# EAGLE schematic Receiver_Schematic_Visualization (EAGLE 6.5.0)
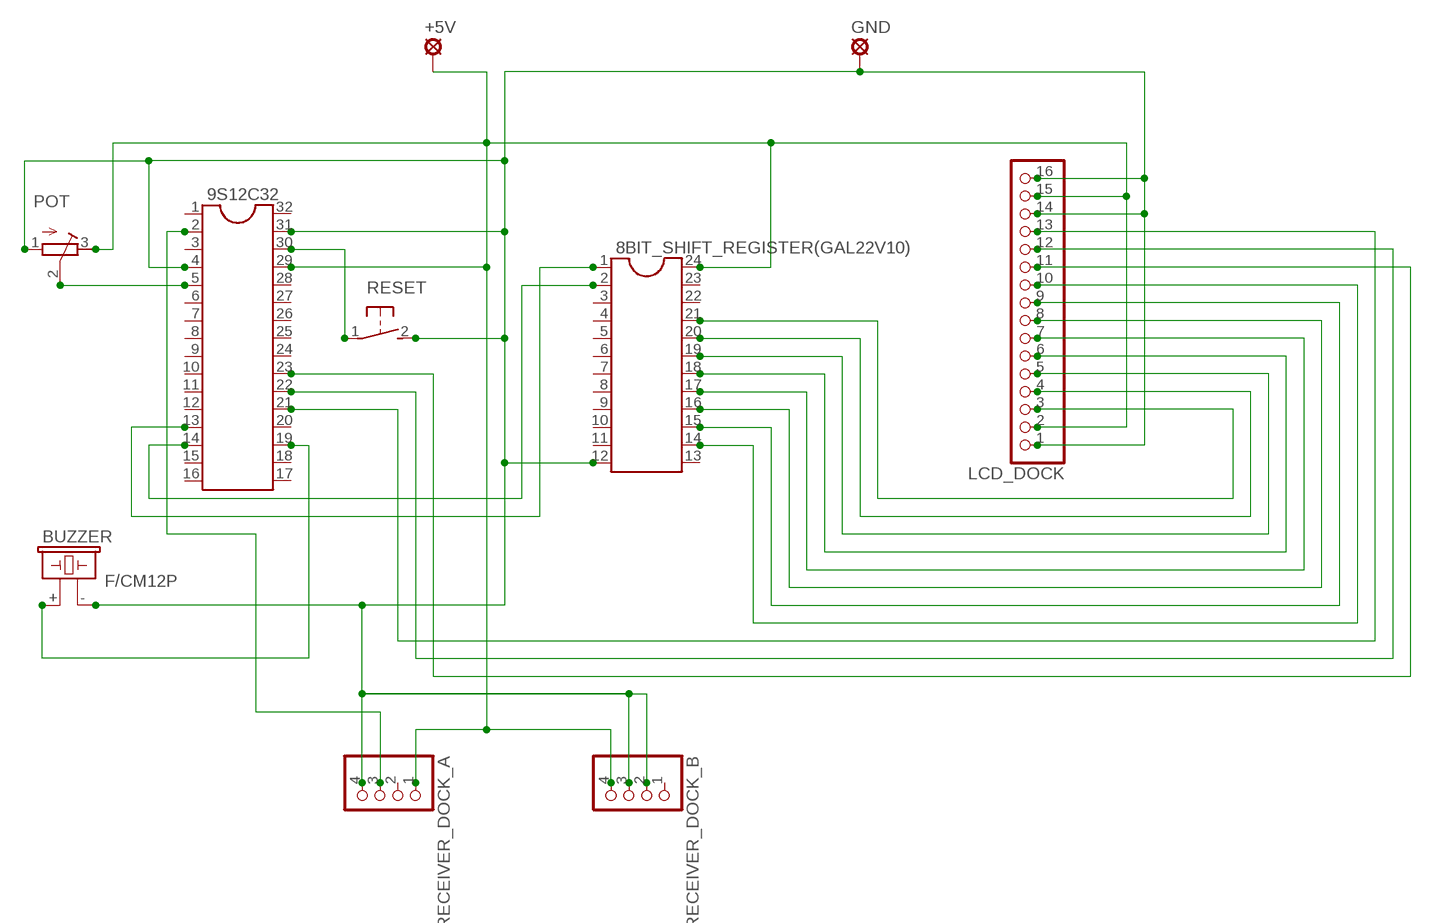
[diagram p0: schematic, sheet 1]

## Parts
8BIT_SHIFT_REGISTER(GAL22V10)  DIL24-6  [DIL24-6]
9S12C32  DIL32  [DIL32]
+5V  LSP10  [LSP10]
BUZZER  F/CM12P  [F/CM12P]
GND  LSP10  [LSP10]
LCD_DOCK  PINHD-1X16/90  [1X16/90]
POT  R-TRIMM3296X  [RTRIM3296X]
RECEIVER_DOCK_A  PINHD-1X4/90  [1X04/90]
RECEIVER_DOCK_B  PINHD-1X4/90  [1X04/90]
RESET  31-XX  [B3F-31XX]

## Nets
N$1: 8BIT_SHIFT_REGISTER(GAL22V10).14 LCD_DOCK.10
N$3: 9S12C32.21 LCD_DOCK.13
N$4: 9S12C32.22 LCD_DOCK.12
N$6: 9S12C32.23 LCD_DOCK.11
N$7: 8BIT_SHIFT_REGISTER(GAL22V10).15 LCD_DOCK.9
N$8: 9S12C32.19 BUZZER.+
N$9: 8BIT_SHIFT_REGISTER(GAL22V10).16 LCD_DOCK.8
N$10: 8BIT_SHIFT_REGISTER(GAL22V10).17 LCD_DOCK.7
N$11: 8BIT_SHIFT_REGISTER(GAL22V10).18 LCD_DOCK.6
N$12: 8BIT_SHIFT_REGISTER(GAL22V10).19 LCD_DOCK.5
N$13: 8BIT_SHIFT_REGISTER(GAL22V10).20 LCD_DOCK.4
N$14: 8BIT_SHIFT_REGISTER(GAL22V10).21 LCD_DOCK.3
N$17: 9S12C32.30 RESET.1(P)
N$19: 9S12C32.5 POT.2(S)
N$23: 8BIT_SHIFT_REGISTER(GAL22V10).24 9S12C32.29 +5V.MP LCD_DOCK.2 LCD_DOCK.15 POT.3(A) RECEIVER_DOCK_A.1 RECEIVER_DOCK_B.4
N$24: 8BIT_SHIFT_REGISTER(GAL22V10).12 9S12C32.4 9S12C32.31 BUZZER.- GND.MP LCD_DOCK.1 LCD_DOCK.14 LCD_DOCK.16 POT.1(E) RECEIVER_DOCK_A.4 RECEIVER_DOCK_B.2 RECEIVER_DOCK_B.3 RESET.2(S)
N$26: 9S12C32.2 RECEIVER_DOCK_A.3
N$27: 8BIT_SHIFT_REGISTER(GAL22V10).1 9S12C32.13
N$28: 8BIT_SHIFT_REGISTER(GAL22V10).2 9S12C32.14
Unconnected: 8BIT_SHIFT_REGISTER(GAL22V10).3 8BIT_SHIFT_REGISTER(GAL22V10).4 8BIT_SHIFT_REGISTER(GAL22V10).5 8BIT_SHIFT_REGISTER(GAL22V10).6 8BIT_SHIFT_REGISTER(GAL22V10).7 8BIT_SHIFT_REGISTER(GAL22V10).8 8BIT_SHIFT_REGISTER(GAL22V10).9 8BIT_SHIFT_REGISTER(GAL22V10).10 8BIT_SHIFT_REGISTER(GAL22V10).11 8BIT_SHIFT_REGISTER(GAL22V10).13 8BIT_SHIFT_REGISTER(GAL22V10).22 8BIT_SHIFT_REGISTER(GAL22V10).23 9S12C32.1 9S12C32.3 9S12C32.6 9S12C32.7 9S12C32.8 9S12C32.9 9S12C32.10 9S12C32.11 9S12C32.12 9S12C32.15 9S12C32.16 9S12C32.17 9S12C32.18 9S12C32.20 9S12C32.24 9S12C32.25 9S12C32.26 9S12C32.27 9S12C32.28 9S12C32.32 RECEIVER_DOCK_A.2 RECEIVER_DOCK_B.1

## Library data of the parts
8BIT_SHIFT_REGISTER(GAL22V10) = ic-package:DIL24: Dual In Line
9S12C32 = ic-package:DIL32: Dual In Line
+5V GND = solpad:LSP10: SOLDER PAD drill 1.0 mm, distributor Buerklin, 12H555
BUZZER = buzzer:F/CM12P: BUZZER Source: Buerklin; OC_FARNELL: unknown; OC_NEWARK: unknown
LCD_DOCK = pinhead:PINHD-1X16: PIN HEADER
POT = resistor:R-TRIMM: Trimm resistor
RECEIVER_DOCK_A RECEIVER_DOCK_B = pinhead:PINHD-1X4: PIN HEADER
RESET = switch-omron:31-XX: OMRON SWITCH; MPN: B3F-3100; OC_FARNELL: 959704; OC_NEWARK: 36M3582